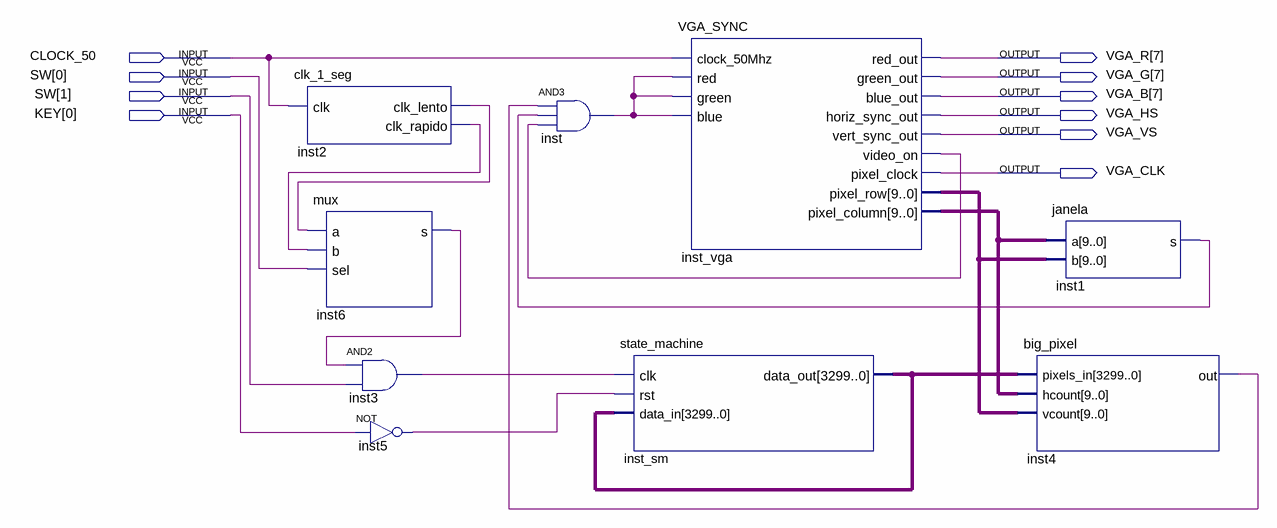
[diagram p0: schematic sheet]
// Quartus schematic pratica04.bdf as structural Verilog: 9 symbols, 10 pins
module pratica04 (
  input  CLOCK_50,
  input  [1:0] SW,
  input  [0:0] KEY,
  output [7:7] VGA_R,
  output [7:7] VGA_G,
  output [7:7] VGA_B,
  output VGA_HS,
  output VGA_VS,
  output VGA_CLK
);

  wire inst1_s, inst2_clk_lento, inst2_clk_rapido, inst3_out, inst4_out, inst5_out, inst6_s, inst_out,
       inst_vga_video_on;
  wire [9:0] inst_vga_pixel_column, inst_vga_pixel_row;
  wire [3299:0] inst_sm_data_out;

  clk_1_seg inst2 (.clk(CLOCK_50), .clk_lento(inst2_clk_lento), .clk_rapido(inst2_clk_rapido));
  mux inst6 (.a(inst2_clk_lento), .b(inst2_clk_rapido), .sel(SW[0]), .s(inst6_s));
  and inst3 (inst3_out, inst6_s, SW[1]);
  not inst5 (inst5_out, KEY[0]);
  and inst (inst_out, inst4_out, inst1_s, inst_vga_video_on);
  VGA_SYNC inst_vga (
    .clock_50Mhz(CLOCK_50), .red(inst_out), .green(inst_out), .blue(inst_out), .red_out(VGA_R[7]),
    .green_out(VGA_G[7]), .blue_out(VGA_B[7]), .horiz_sync_out(VGA_HS), .vert_sync_out(VGA_VS),
    .video_on(inst_vga_video_on), .pixel_clock(VGA_CLK), .pixel_row(inst_vga_pixel_row),
    .pixel_column(inst_vga_pixel_column));
  state_machine inst_sm (.clk(inst3_out), .rst(inst5_out), .data_in(inst_sm_data_out), .data_out(inst_sm_data_out));
  janela inst1 (.a(inst_vga_pixel_column), .b(inst_vga_pixel_row), .s(inst1_s));
  big_pixel inst4 (
    .pixels_in(inst_sm_data_out), .hcount(inst_vga_pixel_column), .vcount(inst_vga_pixel_row), .out(inst4_out));
endmodule
